# EAGLE schematic Temp_WiFi (EAGLE 8.4.1)
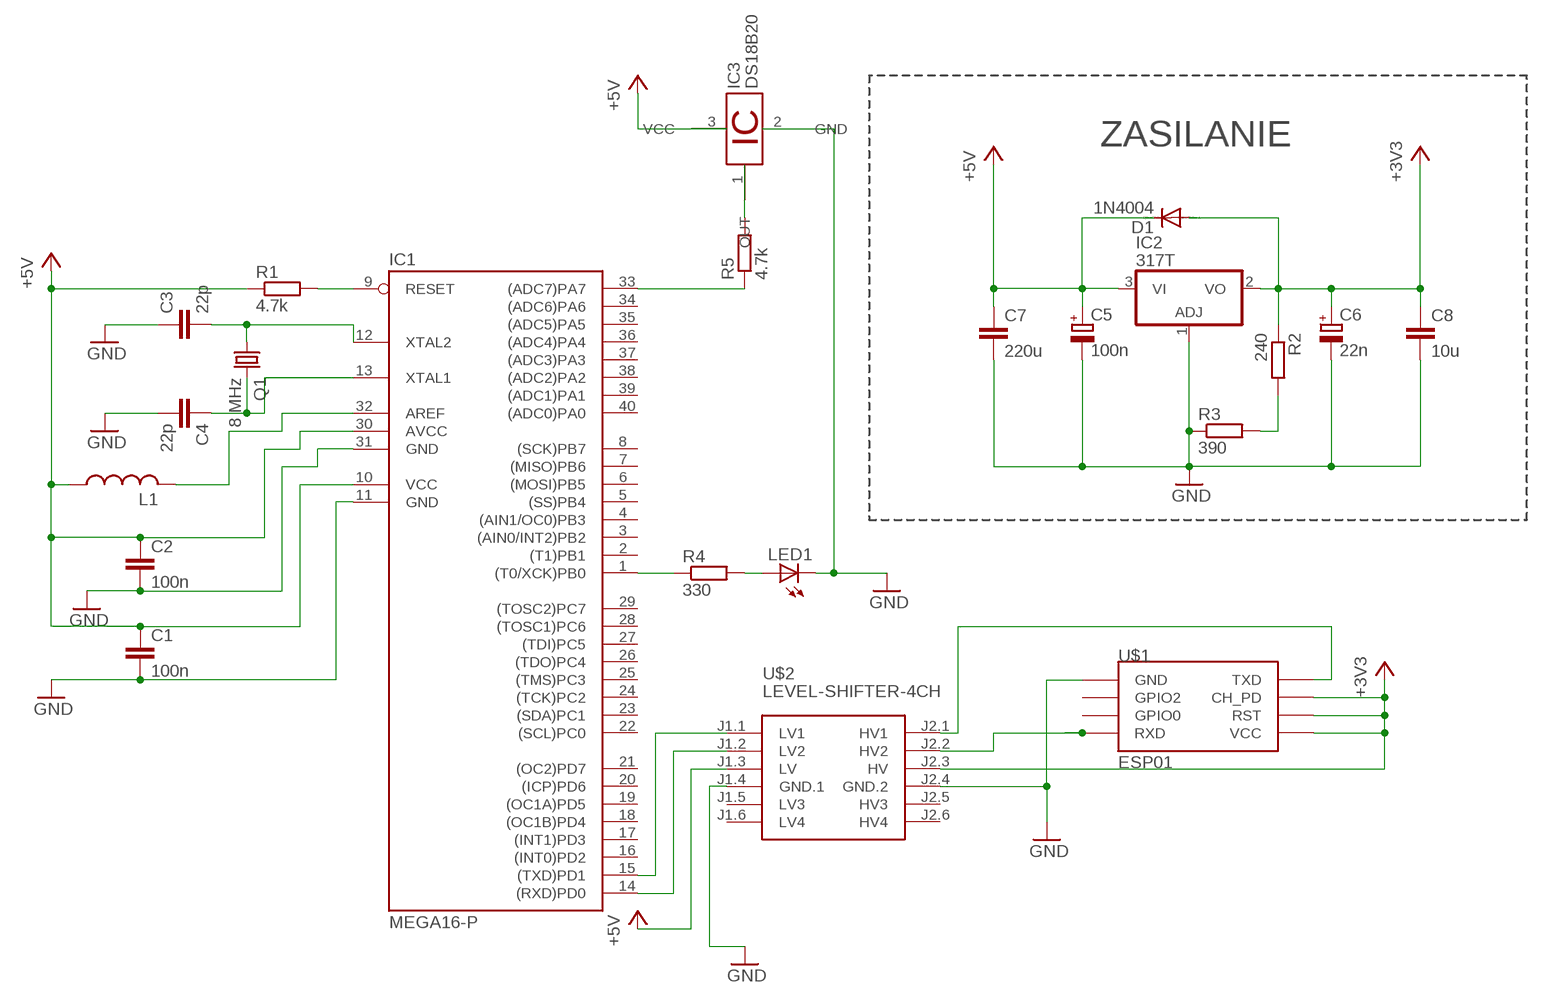
[diagram p0: schematic, sheet 1]

## Parts
C1  100n  C-EU025-040X050  [C025-040X050]
C2  100n  C-EU025-040X050  [C025-040X050]
C3  22p  C-EU025-040X050  [C025-040X050]
C4  22p  C-EU025-040X050  [C025-040X050]
C5  100n  CPOL-EUE7.5-16  [E7,5-16]
C6  22n  CPOL-EUE7.5-16  [E7,5-16]
C7  220u  C-EU025-030X050  [C025-030X050]
C8  10u  C-EU025-030X050  [C025-030X050]
D1  1N4004  [DO41-10]
IC1  MEGA16-P  [DIL40]
IC2  317T  [TO220H]
IC3  DS18B20  [TO92-]
L1  L-US0204/7  [0204/7]
LED1  LED5MM  [LED5MM]
Q1  8 MHz  CRYSTALHC49U-V  [HC49U-V]
R1  4.7k  R-EU_0204/7  [0204/7]
R2  240  R-EU_0204/7  [0204/7]
R3  390  R-EU_0204/7  [0204/7]
R4  330  R-EU_0204/7  [0204/7]
R5  4.7k  R-EU_0204/7  [0204/7]
U$1  ESP01  [ESP01]
U$2  LEVEL-SHIFTER-4CH  [LEVEL-SHIFTER-4CH]

## Nets
+3V3: C6.+ C8.1 D1.A IC2.2(VO) R2.1 U$1.CH_PD U$1.RST U$1.VCC U$2.J2.3(HV)
+5V: C1.1 C2.1 C5.+ C7.1 D1.C IC1.10(VCC) IC1.30(AVCC) IC2.3(VI) IC3.3(VCC) L1.1 R1.1 U$2.J1.3(LV)
GND: C1.2 C2.2 C3.1 C4.2 C5.- C6.- C7.2 C8.2 IC1.11(GND) IC1.31(GND) IC2.1(ADJ) IC3.2(GND) LED1.K(C) R3.1 U$1.GND U$2.J1.4(GND.1) U$2.J2.4(GND.2)
N$1: IC1.9(RESET) R1.2
N$2: IC1.32(AREF) L1.2
N$3: IC1.1((T0/XCK)PB0) R4.1
N$4: LED1.A R4.2
N$5: U$1.RX(RXD) U$2.J2.2(HV2)
N$6: U$1.TX(TXD) U$2.J2.1(HV1)
N$7: IC1.15((TXD)PD1) U$2.J1.1(LV1)
N$8: IC1.14((RXD)PD0) U$2.J1.2(LV2)
N$9: IC1.33((ADC7)PA7) R5.1
N$10: IC3.1(OUT) R5.2
N$11: R2.2 R3.2
XTAL2: C3.2 C4.1 IC1.12(XTAL2) IC1.13(XTAL1) Q1.1 Q1.2
Unconnected: IC1.2((T1)PB1) IC1.3((AIN0/INT2)PB2) IC1.4((AIN1/OC0)PB3) IC1.5((SS)PB4) IC1.6((MOSI)PB5) IC1.7((MISO)PB6) IC1.8((SCK)PB7) IC1.16((INT0)PD2) IC1.17((INT1)PD3) IC1.18((OC1B)PD4) IC1.19((OC1A)PD5) IC1.20((ICP)PD6) IC1.21((OC2)PD7) IC1.22((SCL)PC0) IC1.23((SDA)PC1) IC1.24((TCK)PC2) IC1.25((TMS)PC3) IC1.26((TDO)PC4) IC1.27((TDI)PC5) IC1.28((TOSC1)PC6) IC1.29((TOSC2)PC7) IC1.34((ADC6)PA6) IC1.35((ADC5)PA5) IC1.36((ADC4)PA4) IC1.37((ADC3)PA3) IC1.38((ADC2)PA2) IC1.39((ADC1)PA1) IC1.40((ADC0)PA0) U$1.GPIO0 U$1.GPIO2 U$2.J1.5(LV3) U$2.J1.6(LV4) U$2.J2.5(HV3) U$2.J2.6(HV4)

## Notes on the sheet
- ZASILANIE

## Library data of the parts
C1-C4 C7 C8 = rcl:C-EU: CAPACITOR, European symbol
C5 C6 = rcl:CPOL-EU: POLARIZED CAPACITOR, European symbol
D1 = diode:1N4004: DIODE general purpose rectifier, 1 A
IC1 = atmel:MEGA16-P: MICROCONTROLLER 16 Kbytes FLASH 1 kbytes SRAM 512 bytes EEPROM USART 8-channel 10 bit ADC Source: avr.lbr; MPN: ATMEGA16-16PU; OC_FARNELL: 9171142; OC_NEWARK: 01M6885
IC2 = linear:*317: Positive VOLTAGE REGULATOR
IC3 = 1wire:DS18B20: Programmable Resolution Digital Thermometer This chip provides a onewire thermosensor with approx. 0.5°C accuracy. A programmable over/undertemperure alarm is available. The precision can be set from 9..12 bits. Notes: Vdd must be applied for accurate measurements at low temperatures, as the parasite power circuit otherwise heats the sensor. If parasite power is used, Vdd has to be connected to GND. The DS1822 is a low-cost thermometer chip, the DS18S20 is similar to the DS18B20, but with 9 Bit precision only. Author: Jan Kandziora <jjj@gmx.de>
L1 = rcl:L-US: INDUCTOR, American symbol
LED1 = led:LED: LED OSRAM: - CHIPLED LG R971, LG N971, LY N971, LG Q971, LY Q971, LO R971, LY R971 LH N974, LH R974 LS Q976, LO Q976, LY Q976 LO Q996 - Hyper CHIPLED LW Q18S LB Q993, LB Q99A, LB R99A - SideLED LS A670, LO A670, LY A670, LG A670, LP A670 LB A673, LV A673, LT A673, LW A673 LH A674 LY A675 LS A676, LA A676, LO A676, LY A676, LW A676 LS A679, LY A679, LG A679 - Hyper Micro SIDELED® LS Y876, LA Y876, LO Y876, LY Y876 LT Y87S - SmartLED LW L88C, LW L88S LB L89C, LB L89S, LG L890 LS L89K, LO L89K, LY L89K LS L896, LA L896, LO L896, LY L896 - TOPLED LS T670, LO T670, LY T670, LG T670, LP T670 LSG T670, LSP T670, LSY T670, LOP T670, LYG T670 LG T671, LOG T671, LSG T671 LB T673, LV T673, LT T673, LW T673 LH T674 LS T676, LA T676, LO T676, LY T676, LB T676, LH T676, LSB T676, LW T676 LB T67C, LV T67C, LT T67C, LS T67K, LO T67K, LY T67K, LW E67C LS E67B, LA E67B, LO E67B, LY E67B, LB E67C, LV E67C, LT E67C LW T67C LS T679, LY T679, LG T679 LS T770, LO T770, LY T770, LG T770, LP T770 LB T773, LV T773, LT T773, LW T773 LH T774 LS E675, LA E675, LY E675, LS T675 LS T776, LA T776, LO T776, LY T776, LB T776 LHGB T686 LT T68C, LB T68C - Hyper Mini TOPLED® LB M676 - Mini TOPLED Santana® LG M470 LS M47K, LO M47K, LY M47K Source: http://www.osram.convergy.de LUXEON: - LUMILED® LXK2-PW12-R00, LXK2-PW12-S00, LXK2-PW14-U00, LXK2-PW14-V00 LXK2-PM12-R00, LXK2-PM12-S00, LXK2-PM14-U00 LXK2-PE12-Q00, LXK2-PE12-R00, LXK2-PE12-S00, LXK2-PE14-T00, LXK2-PE14-U00 LXK2-PB12-K00, LXK2-PB12-L00, LXK2-PB12-M00, LXK2-PB14-N00, LXK2-PB14-P00, LXK2-PB14-Q00 LXK2-PR12-L00, LXK2-PR12-M00, LXK2-PR14-Q00, LXK2-PR14-R00 LXK2-PD12-Q00, LXK2-PD12-R00, LXK2-PD12-S00 LXK2-PH12-R00, LXK2-PH12-S00 LXK2-PL12-P00, LXK2-PL12-Q00, LXK2-PL12-R00 Source: www.luxeon.com KINGBRIGHT: KA-3528ASYC Source: www.kingbright.com
Q1 = crystal:CRYSTAL: CRYSTAL; OC_FARNELL: 1666969; OC_NEWARK: unknown
R1-R5 = rcl:R-EU_: RESISTOR, European symbol
U$1 = esp8266:ESP01: ESP8266 Wifi module 01
U$2 = diy-modules:LEVEL-SHIFTER-4CH: 4-Channel Bi-Directional Logic Level Converter based on BSS128 transistors Click here to find device on ebay.com <http://www.ebay.com/sch/i2c+logic+converter+module>